# EAGLE design LPC_ERT_30_Thermostat_Adapter_v26_final (EAGLE 5.03)
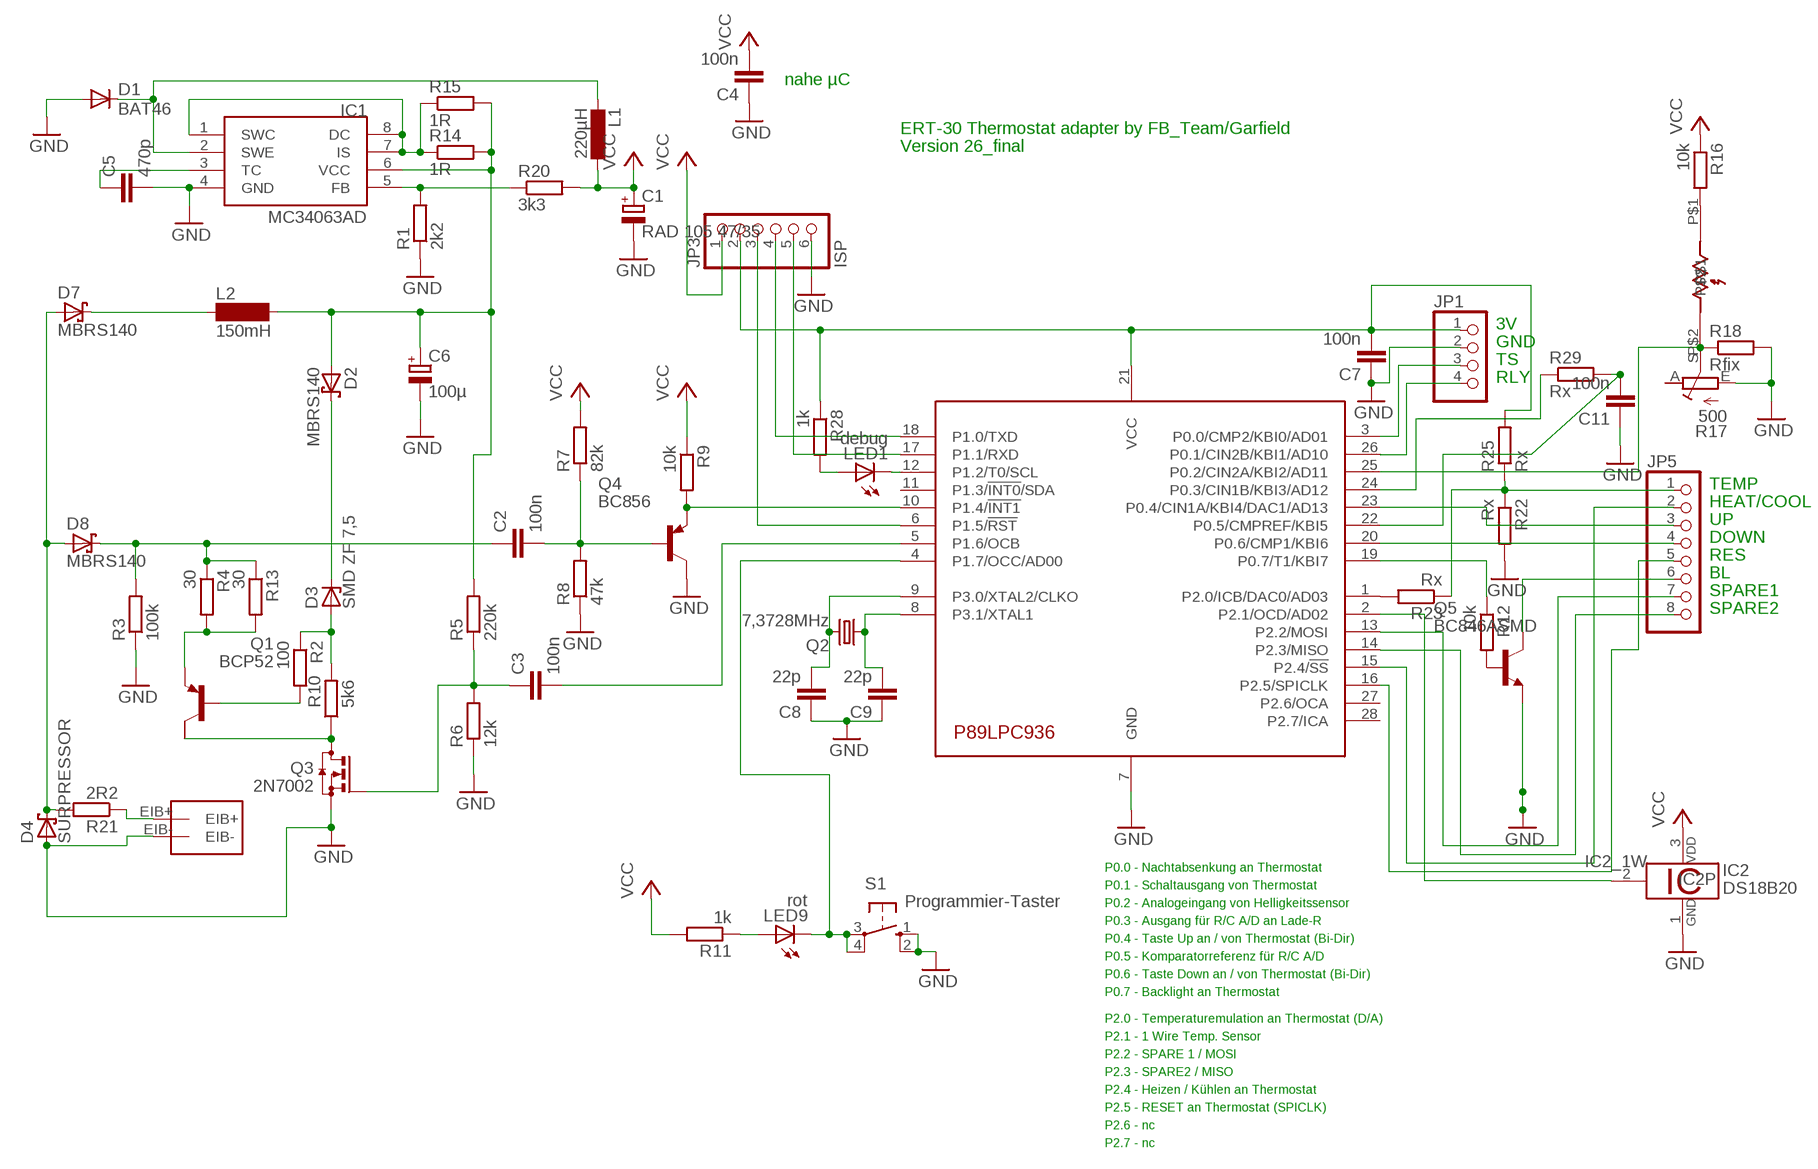
[diagram p0: schematic, sheet 1]

## Parts
C1  RAD 105 47/35  CPOL-EUE2-5  [E2-5]
C2  100n  C-EUC0805  [C0805]
C3  100n  C-EUC0805  [C0805]
C4  100n  C-EUC0805  [C0805]
C5  470p  C-EUC0805  [C0805]
C6  100µ  CPOL-EUE2.5-7  [E2,5-7]
C7  100n  C-EUC0805  [C0805]
C8  22p  C-EUC0805K  [C0805K]
C9  22p  C-EUC0805K  [C0805K]
C11  100n  C-EUC0805  [C0805]
D1  BAT46  DIODE-MINIMELF  [MINIMELF]
D2  MBRS140  MBRS130LT3  [SMB]
D3  SMD ZF 7,5  ZPD  [MINIMELF]
D4  SURPRESSOR  MBRS130LT3  [SMB]
D7  MBRS140  MBRS130LT3  [SMB]
D8  MBRS140  MBRS130LT3  [SMB]
IC1  MC34063AD  [SOIC8]
IC2  DS18B20  [TO92-]
JP1  PINHD-1X4  [1X04]
JP3  ISP  PINHD-1X6  [1X06]
JP5  PINHD-1X8  [1X08]
L1  220µH  L-EU2200-11.43  [2200-11.43]
L2  150mH  SD12-1000  [SD12_1000]
LED1  debug  LEDCHIPLED_1206  [CHIPLED_1206]
LED9  rot  LEDCHIPLED_1206  [CHIPLED_1206]
Q1  BCP52  FZT753SMD  [SOT223]
Q2  7,3728MHz  CRYSTALHC49UP  [HC49UP]
Q3  2N7002  BSS123  [SOT23]
Q4  BC856  BC856ALT1SMD  [SOT23-BEC]
Q5  BC846ASMD  [SOT23]
R1  2k2  R-EU_R0805  [R0805]
R2  100  R-EU_M1206  [M1206]
R3  100k  R-EU_M0805  [M0805]
R4  30  R-EU_R1206  [R1206]
R5  220k  R-EU_M0805  [M0805]
R6  12k  R-EU_M0805  [M0805]
R7  82k  R-EU_R0805  [R0805]
R8  47k  R-EU_M0805  [M0805]
R9  10k  R-EU_R0805  [R0805]
R10  5k6  R-EU_M1206  [M1206]
R11  1k  R-EU_M0805  [M0805]
R12  10k  R-EU_M0805  [M0805]
R13  30  R-EU_R1206  [R1206]
R14  1R  R-EU_M0805  [M0805]
R15  1R  R-EU_M0805  [M0805]
R16  10k  R-EU_M0805  [M0805]
R17  500  R-TRIMM-PT6L  [PT6L]
R18  Rfix  R-EU_M0805  [M0805]
R20  3k3  R-EU_M0805  [M0805]
R21  2R2  R-EU_M1206  [M1206]
R22  Rx  R-EU_M0805  [M0805]
R23  Rx  R-EU_M0805  [M0805]
R25  Rx  R-EU_M0805  [M0805]
R28  1k  R-EU_M0805  [M0805]
R29  Rx  R-EU_M0805  [M0805]
S1  Programmier-Taster  10-XX  [B3F-10XX]
U$1  P89LPC936_SMDPLCC28S  [PLCC28S]
U$2  LDR07  [LDR07]
U$5  EIB-CON  [EIB-CON]

## Nets
GND [supply]: C1.- C4.1 C5.2 C6.- C7.1 C8.1 C9.1 C11.1 D1.A D4.A IC1.4(GND) IC2.1 JP1.2 JP3.6 Q3.2(S) Q4.C Q5.2(E) R1.1 R3.1 R6.1 R8.1 R17.E R18.2 R22.2 S1.1(S) S1.2(S1) U$1.7(GND) U$5.EIB-
N$1: Q4.E R9.2 U$1.10(P1.4/!INT1)
N$2: C2.2 Q4.B R7.1 R8.2
N$3: IC1.5(FB) R1.2 R20.1
N$4: IC1.1(SWC) IC1.7(IS) IC1.8(DC) R14.1 R15.1
N$5: C3.2 U$1.5(P1.6/OCB)
N$6: Q1.2(C) Q3.3(D) R10.1
N$7 [supply]: C6.+ D2.A IC1.6(VCC) L2.2 R5.2 R14.2 R15.2
N$8 [supply]: D7.C L2.1
N$9 [supply]: C2.1 D8.C R3.2 R4.1 R13.1
N$10: D1.C IC1.2(SWE) L1.2
N$11: D3.A R2.1 R10.2
N$12: Q1.3(E) R4.2 R13.2
N$13: C5.1 IC1.3(TC)
N$14: Q1.1(B) R2.2
N$15: C9.2 Q2.1 U$1.8(P3.1/XTAL1)
N$16 [supply]: D4.C D7.A D8.A R21.2
N$17: LED9.C S1.3(P) S1.4(P1) U$1.4(P1.7/OCC/AD00)
N$18: C8.2 Q2.2 U$1.9(P3.0/XTAL2/CLKO)
N$19: JP5.3 U$1.23(P0.4/CIN1A/KBI4/DAC1/AD13)
N$20: Q5.1(B) R12.2
N$21: R12.1 U$1.19(P0.7/T1/KBI7)
N$22: JP1.3 U$1.3(P0.0/CMP2/KBI0/AD01)
N$23: JP1.4 U$1.26(P0.1/CIN2B/KBI1/AD10)
N$24: JP5.6 Q5.3(C)
N$25: JP5.5 U$1.16(P2.5/SPICLK)
N$26: C11.2 R29.2 U$1.22(P0.5/CMPREF/KBI5)
N$27: JP5.2 U$1.15(P2.4/!SS)
N$28: LED1.C U$1.12(P1.2/T0/SCL)
N$29: JP3.4 U$1.18(P1.0/TXD)
N$30: JP3.5 U$1.17(P1.1/RXD)
N$31: JP3.3 U$1.6(P1.5/!RST)
N$33: R16.2 U$2.P$1
N$34: C3.1 Q3.1(G) R5.1 R6.2
N$35: C7.2 JP1.1 JP3.2 R25.2 R28.1 U$1.21(VCC)
N$36: IC2.2 U$1.2(P2.1/OCD/AD02)
N$37: R17.S R18.1 U$1.25(P0.2/CIN2A/KBI2/AD11) U$2.P$2
N$38: JP5.7 U$1.13(P2.2/MOSI)
N$39: R21.1 U$5.EIB+
N$40: D2.C D3.C
N$41: LED9.A R11.1
N$44: JP5.8 U$1.14(P2.3/MISO)
N$46: JP5.1 R22.1 R23.1 R25.1
N$47: R23.2 U$1.1(P2.0/ICB/DAC0/AD03)
N$49: LED1.A R28.2
N$50: R29.1 U$1.24(P0.3/CIN1B/KBI3/AD12)
N$51: JP5.4 U$1.20(P0.6/CMP1/KBI6)
VCC [supply]: C1.+ C4.2 IC2.3 JP3.1 L1.1 R7.2 R9.1 R11.2 R16.1 R20.2
Unconnected: Q1.4(C/) R17.A U$1.11(P1.3/!INT0!/SDA) U$1.27(P2.6/OCA) U$1.28(P2.7/ICA)

## Notes on the sheet
- nahe µC
- ERT-30 Thermostat adapter by FB_Team/Garfield
- Version 26_final
- 3V
- GND
- TS
- RLY
- TEMP
- HEAT/COOL
- UP
- DOWN
- RES
- BL
- SPARE1
- SPARE2
- P0.0 - Nachtabsenkung an Thermostat
- P0.1 - Schaltausgang von Thermostat
- P0.2 - Analogeingang von Helligkeitssensor
- P0.3 - Ausgang für R/C A/D an Lade-R
- P0.4 - Taste Up an / von Thermostat (Bi-Dir)
- P0.5 - Komparatorreferenz für R/C A/D
- P0.6 - Taste Down an / von Thermostat (Bi-Dir)
- P0.7 - Backlight an Thermostat
- P2.0 - Temperaturemulation an Thermostat (D/A)
- P2.1 - 1 Wire Temp. Sensor
- P2.2 - SPARE 1 / MOSI
- P2.3 - SPARE2 / MISO
- P2.4 - Heizen / Kühlen an Thermostat
- P2.5 - RESET an Thermostat (SPICLK)
- P2.6 - nc
- P2.7 - nc

## Library data of the parts
C1 C6 = rcl:CPOL-EU: POLARIZED CAPACITOR, European symbol
C2-C5 C7-C9 C11 = rcl:C-EU: CAPACITOR, European symbol
D1 = diode:DIODE-: DIODE
D2 D4 D7 D8 = diode:MBRS130LT3: Schottky Power Rectifier Source: http://www.onsemi.com/pub/Collateral/MBRS130LT3-D.PDF
D3 = diode:ZPD: Z DIODE 500 mW
IC1 = mc34063:MC34063
IC2 = 1wire:DS18B20: Programmable Resolution Digital Thermometer This chip provides a onewire thermosensor with approx. 0.5°C accuracy. A programmable over/undertemperure alarm is available. The precision can be set from 9..12 bits. Notes: Vdd must be applied for accurate measurements at low temperatures, as the parasite power circuit otherwise heats the sensor. If parasite power is used, Vdd has to be connected to GND. The DS1822 is a low-cost thermometer chip, the DS18S20 is similar to the DS18B20, but with 9 Bit precision only. Author: Jan Kandziora <jjj@gmx.de>
JP1 = pinhead:PINHD-1X4: PIN HEADER
JP3 = pinhead:PINHD-1X6: PIN HEADER
JP5 = pinhead:PINHD-1X8: PIN HEADER
L1 = rcl:L-EU: INDUCTOR, European symbol
L2 = inductor-neosid:SD12: INDUCTOR nominal inductance
LED1 LED9 = led:LED: LED OSRAM: - CHIPLED LG R971, LG N971, LY N971, LG Q971, LY Q971, LO R971, LY R971 LH N974, LH R974 LS Q976, LO Q976, LY Q976 LO Q996 - Hyper CHIPLED LW Q18S LB Q993, LB Q99A, LB R99A - SideLED LS A670, LO A670, LY A670, LG A670, LP A670 LB A673, LV A673, LT A673, LW A673 LH A674 LY A675 LS A676, LA A676, LO A676, LY A676, LW A676 LS A679, LY A679, LG A679 - Hyper Micro SIDELED® LS Y876, LA Y876, LO Y876, LY Y876 LT Y87S - SmartLED LW L88C, LW L88S LB L89C, LB L89S, LG L890 LS L89K, LO L89K, LY L89K LS L896, LA L896, LO L896, LY L896 - TOPLED LS T670, LO T670, LY T670, LG T670, LP T670 LSG T670, LSP T670, LSY T670, LOP T670, LYG T670 LG T671, LOG T671, LSG T671 LB T673, LV T673, LT T673, LW T673 LH T674 LS T676, LA T676, LO T676, LY T676, LB T676, LH T676, LSB T676, LW T676 LB T67C, LV T67C, LT T67C, LS T67K, LO T67K, LY T67K, LW E67C LS E67B, LA E67B, LO E67B, LY E67B, LB E67C, LV E67C, LT E67C LW T67C LS T679, LY T679, LG T679 LS T770, LO T770, LY T770, LG T770, LP T770 LB T773, LV T773, LT T773, LW T773 LH T774 LS E675, LA E675, LY E675, LS T675 LS T776, LA T776, LO T776, LY T776, LB T776 LHGB T686 LT T68C, LB T68C - Hyper Mini TOPLED® LB M676 - Mini TOPLED Santana® LG M470 LS M47K, LO M47K, LY M47K Source: http://www.osram.convergy.de LUXEON: - LUMILED® LXK2-PW12-R00, LXK2-PW12-S00, LXK2-PW14-U00, LXK2-PW14-V00 LXK2-PM12-R00, LXK2-PM12-S00, LXK2-PM14-U00 LXK2-PE12-Q00, LXK2-PE12-R00, LXK2-PE12-S00, LXK2-PE14-T00, LXK2-PE14-U00 LXK2-PB12-K00, LXK2-PB12-L00, LXK2-PB12-M00, LXK2-PB14-N00, LXK2-PB14-P00, LXK2-PB14-Q00 LXK2-PR12-L00, LXK2-PR12-M00, LXK2-PR14-Q00, LXK2-PR14-R00 LXK2-PD12-Q00, LXK2-PD12-R00, LXK2-PD12-S00 LXK2-PH12-R00, LXK2-PH12-S00 LXK2-PL12-P00, LXK2-PL12-Q00, LXK2-PL12-R00 Source: www.luxeon.com KINGBRIGHT: KA-3528ASYC Source: www.kingbright.com
Q1 = transistor-pnp:FZT753SMD: PNP Transistor
Q2 = crystal:CRYSTAL: CRYSTAL
Q3 = transistor-small-signal:BSS123: N-CHANNEL MOS FET
Q4 = transistor-pnp:BC856*: PNP Transistror
Q5 = transistor-npn:BC846*: NPN Transistor
R1-R16 R18 R20-R23 R25 R28 R29 = rcl:R-EU_: RESISTOR, European symbol
R17 = kubi:R-TRIMM
S1 = switch-omron:10-XX: OMRON SWITCH
U$1 = micro-philips:P89LPC936_SMD
U$2 = ldr:LDR07
U$5 = EIBdevices:EIB-CON

## Board
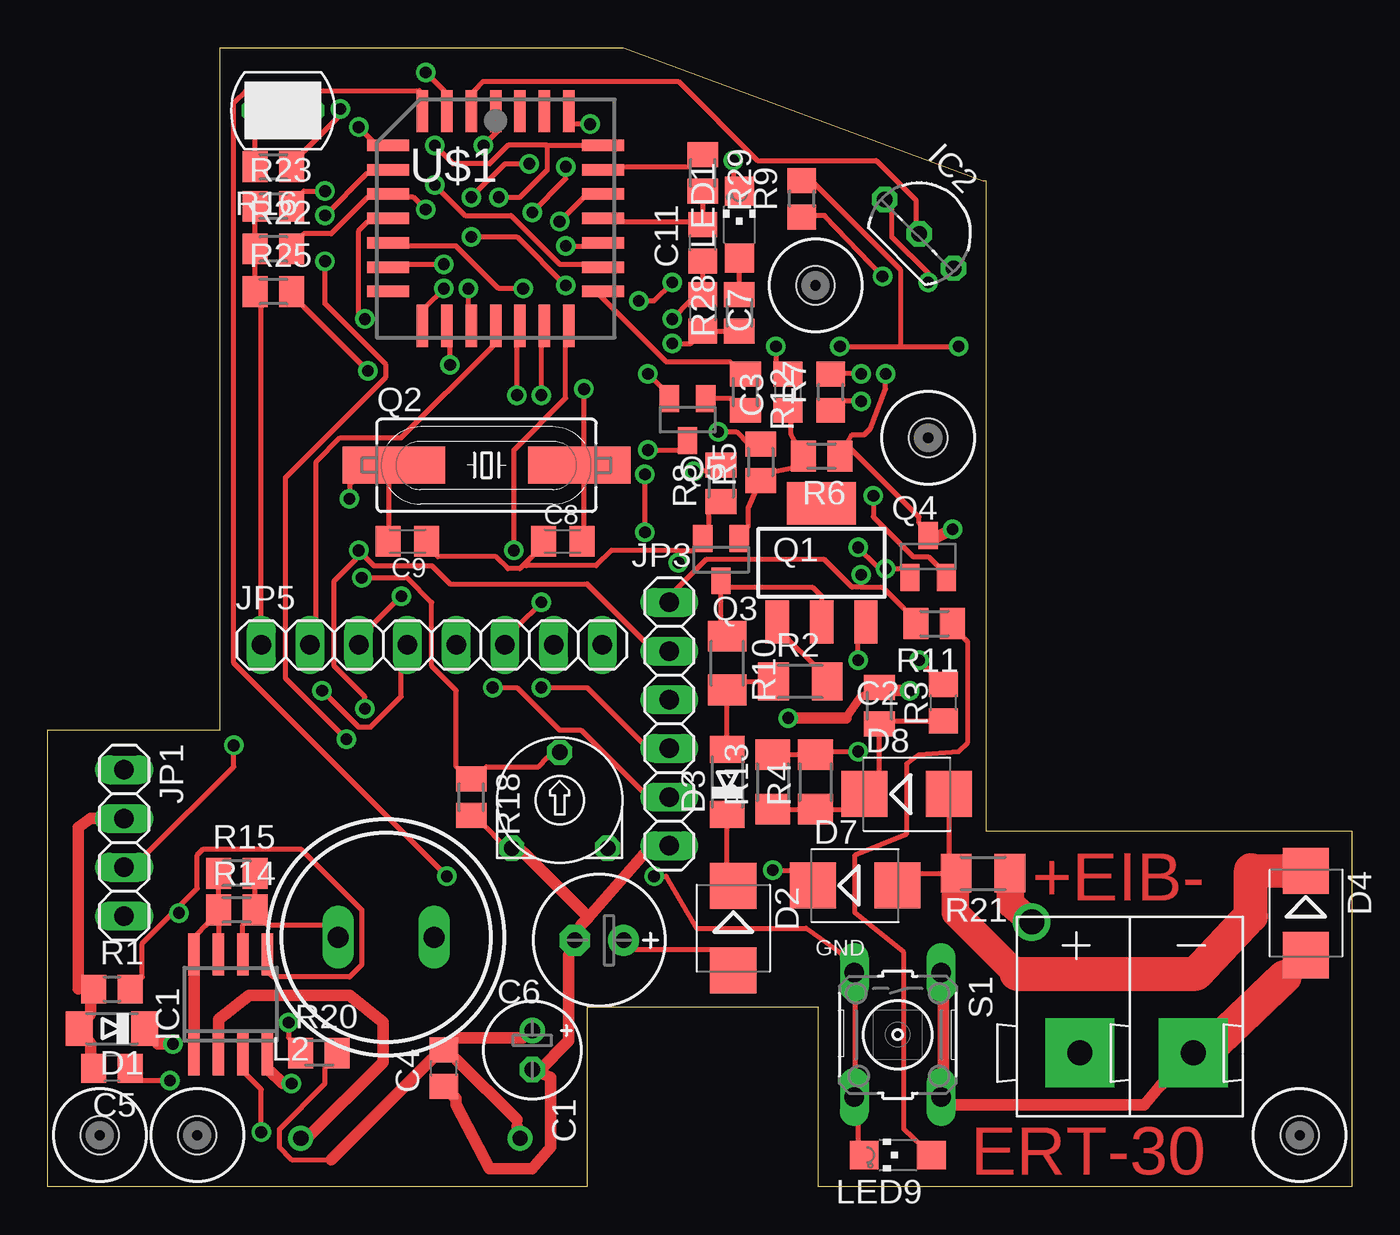
[diagram p1: board, top side]
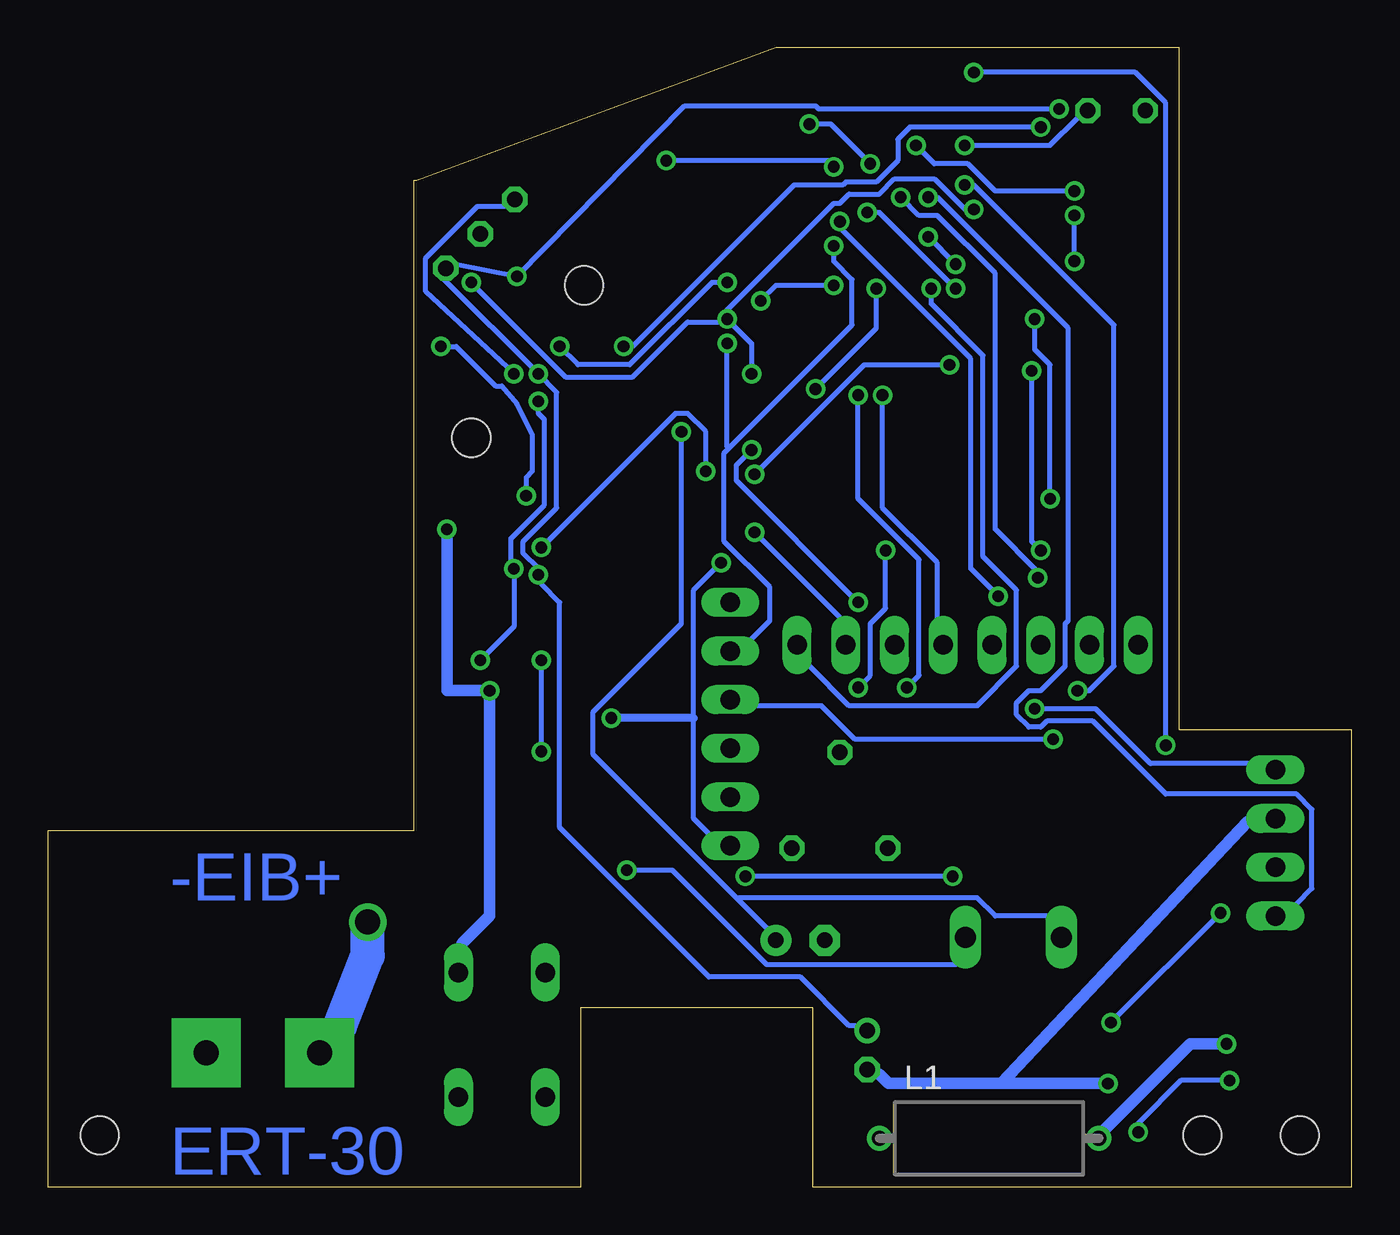
[diagram p2: board, bottom side, seen from below]

Size 67.94 x 59.37 mm. Coordinates in mm from the lower left corner, seen from the top.
Outline: 48.74,52.47 30,59.37 8.97,59.37 8.97,23.81 0,23.81 0,0 28.1,0 28.1,9.37 40.16,9.37 40.16,0 67.94,0 67.94,18.57 48.9,18.57 48.9,52.47 48.74,52.47
Outline: 48.74,52.47 48.74,52.47
Copper layers (1*16): Top 0.035mm / dielectric 1.5mm / Bottom 0.035mm
Design rules "Bilex DRU *": minimum track width 10mil, minimum drill 24mil, track to track 10mil, track to pad 10mil, pad to pad 10mil, via to via 10mil, smd to smd 10mil, copper to edge 20mil, drill to drill 8mil, minimum pad ring 10mil, minimum via ring 8mil, stop-mask expansion 4mil, vias tented up to drill 0mil, thermal gap 10mil

### Footprints (pad centres in the part's own frame; a part is rotated, then mirrored left to right if it is on the bottom)
E2-5 = drill 0.813 pad 1.27 round: + -1.016,0 | drill 0.813 pad 1.27 octagon: - 1.016,0
C0805 = smd 1.3 x 1.5: 1 -0.95,0; 2 0.95,0
E2,5-7 = drill 0.813 pad 1.6 round: + -1.27,0 | drill 0.813 pad 1.6 octagon: - 1.27,0
C0805K = smd 1.3 x 1.6: 1 -1,0; 2 1,0
MINIMELF = smd 1.4 x 1.8: A 1.7,0; C -1.7,0
SMB = smd 2.4 x 2.4: A 2.2,0; C -2.2,0
SOIC8 = smd 0.6 x 2.2: 1 -1.905,-2.6; 2 -0.635,-2.6; 3 0.635,-2.6; 4 1.905,-2.6; 5 1.905,2.6; 6 0.635,2.6; 7 -0.635,2.6; 8 -1.905,2.6
TO92- = drill 0.813 octagon: 1 -2.54,0; 2 0,0; 3 2.54,0
1X04 = drill 1.016 long: 1 -3.81,0; 2 -1.27,0; 3 1.27,0; 4 3.81,0
1X06 = drill 1.016 long: 1 -6.35,0; 2 -3.81,0; 3 -1.27,0; 4 1.27,0; 5 3.81,0; 6 6.35,0
1X08 = drill 1.016 long: 1 -8.89,0; 2 -6.35,0; 3 -3.81,0; 4 -1.27,0; 5 1.27,0; 6 3.81,0; 7 6.35,0; 8 8.89,0
2200-11.43 = drill 0.8 pad 1.27 round: 1 -5.715,0; 2 5.715,0
SD12_1000 = drill 1.1 long: 1 -2.5,0; 2 2.5,0
CHIPLED_1206 = smd 1.5 x 1.5: A 0,-1.75; C 0,1.75
SOT223 = smd 1.219 x 2.235: 1 -2.311,-3.099; 2 0,-3.099; 3 2.311,-3.099 | smd 3.6 x 2.2: 4 0,3.099
HC49UP = smd 5.334 x 1.93: 1 -4.826,0; 2 4.826,0
SOT23 = smd 1 x 1.4: 1 -0.95,-1.1; 2 0.95,-1.1; 3 0,1.1
SOT23-BEC = smd 1 x 1.4: B -0.95,-1.1; C 0,1.1; E 0.95,-1.1
R0805 = smd 1.3 x 1.5: 1 -0.95,0; 2 0.95,0
M1206 = smd 1.6 x 2: 1 -1.4,0; 2 1.4,0
M0805 = smd 1.3 x 1.6: 1 -0.95,0; 2 0.95,0
R1206 = smd 1.6 x 1.803: 1 -1.422,0; 2 1.422,0
PT6L = drill 0.8 octagon: A 2.5,2.5; E 2.5,-2.5; S -2.5,0
B3F-10XX = drill 1.016 long: 1 -3.251,2.261; 2 3.251,2.261; 3 -3.251,-2.261; 4 3.251,-2.261
PLCC28S = smd 0.6 x 2.2: 1 0,5.6; 2 -1.27,5.6; 3 -2.54,5.6; 4 -3.81,5.6; 12 -3.81,-5.6; 13 -2.54,-5.6; 14 -1.27,-5.6; 15 0,-5.6; 16 1.27,-5.6; 17 2.54,-5.6; 18 3.81,-5.6; 26 3.81,5.6; 27 2.54,5.6; 28 1.27,5.6 | smd 2.2 x 0.6: 5 -5.6,3.81; 6 -5.6,2.54; 7 -5.6,1.27; 8 -5.6,0; 9 -5.6,-1.27; 10 -5.6,-2.54; 11 -5.6,-3.81; 19 5.6,-3.81; 20 5.6,-2.54; 21 5.6,-1.27; 22 5.6,0; 23 5.6,1.27; 24 5.6,2.54; 25 5.6,3.81
LDR07 = drill 0.8 octagon: P$1 -1.5,0; P$2 1.5,0
DRIL-2 = hole 2: 0,0
EIB-CON = drill 1.3 pad 3.6 square: EIB+ -5.9,0; EIB- 0,0

### Placement (x,y rotation side)
C1  25.24,7.14 270 top
C2  46.67,25.24 90 top
C3  38.58,41.43 90 top
C4  20.64,6.19 90 top
C5  3.33,6.19 180 top
C6  28.73,12.86 180 top
C7  34.13,45.56 270 top
C8  26.83,33.66 0 top
C9  18.73,33.65 180 top
C11  34.13,49.21 90 top
D1  3.33,8.25 180 top
D2  35.72,13.49 270 top
D3  35.4,21.11 90 top
D4  65.56,14.29 270 top
D7  42.07,15.72 0 top
D8  44.77,20.48 0 top
IC1  9.53,9.53 0 top
IC2  45.4,49.69 315 top
JP1  3.97,17.94 270 top
JP3  32.38,24.13 270 top
JP5  20,28.26 0 top
L1  18.89,2.54 0 bottom
L2  17.62,13.02 180 top
LED1  36.04,50.16 0 top
LED9  44.29,1.67 90 top
Q1  40.32,32.54 0 top
Q2  22.86,37.62 0 top
Q3  35.08,32.7 180 top
Q4  45.88,32.86 0 top
Q5  33.34,40.01 180 top
R1  3.33,10.32 0 top
R2  39.21,26.35 0 top
R3  43.34,25.08 270 top
R4  40,21.11 90 top
R5  37.15,37.78 90 top
R6  40.32,38.1 180 top
R7  40.8,41.43 90 top
R8  35.08,36.67 90 top
R9  39.29,51.51 90 top
R10  35.4,27.3 270 top
R11  46.2,29.37 180 top
R12  36.35,41.43 270 top
R13  37.78,21.11 90 top
R14  9.84,14.45 0 top
R15  9.84,16.35 0 top
R16  11.75,53.18 180 top
R17  26.67,20.16 270 top
R18  22.07,20.32 270 top
R20  14.13,6.99 0 top
R21  48.74,16.35 180 top
R22  47k  [M0805]  11.75,48.9 0 top
R23  47k  [M0805]  11.75,51.12 0 top
R25  47k  [M0805]  11.75,46.67 0 top
R28  36.04,45.56 90 top
R29  100k  [M0805]  34.13,52.86 270 top
S1  44.29,7.94 270 top
U$1  23.34,50.48 0 top
U$2  12.25,56.11 0 top
U$3  [DRIL-2]  45.88,39.05 0 top
U$4  [DRIL-2]  40.01,46.99 0 top
U$5  59.69,6.99 0 top
U$6  [DRIL-2]  2.7,2.7 0 top
U$7  [DRIL-2]  7.78,2.7 0 top
U$8  [DRIL-2]  65.25,2.7 0 top

### Tracks (layer width: path | path; a pad name or v marks a point on that pad's centre or on a via)
GND  (via drill 0.61)
  Top 0.254: R8.1 34.45,35.4 34.45,34.45 Q3.2 33.66,33.18 32.86,33.18 | 24.84,32.46 25.24,32.86 C8.1 | 24.84,32.46 24.61,32.23 23.97,32.23 23.34,32.86 20.32,32.86 C9.1 | 32.86,33.18 29.37,33.18 28.58,32.38 24.92,32.38 24.84,32.46 | R18.2 22.86,18.73 23.65,17.94 R17.E | v32.86,32.54 32.86,33.18 | C5.2 2.22,6.83 | 2.22,9.68 R1.1 1.59,10.32 | 11.59,6.03 IC1.4 | R22.2 13.34,49.69 14.76,49.69 16.67,51.59 U$1.7 18.73,51.59 19.05,51.59 v19.68,50.96 | v31.27,42.39 31.91,41.75 Q5.2 | v32.54,45.24 33.5,46.2 C7.1 34.13,47.62 C11.1 | v43.66,42.39 43.66,41.59 42.86,39.53 42.55,39.21 41.91,39.21 R6.1 41.91,38.42 45.4,34.92 45.4,34.61 Q4.C 46.2,33.81 | 64.45,10.95 D4.A | R3.1 44.13,25.88 | v45.88,47.15 45.88,47.62 43.97,49.53 43.97,50.96 IC2.1 | JP1.2 | 57.94,5.24
  Top 0.406: 41.59,24.45 42.39,25.56 R3.1
  Top 0.61: 28.18,14.05 27.78,13.65 C6.- 27.15,12.07 27.15,7.62 25.56,6.03 C1.- 26.19,5.71 26.19,2.06 25.24,0.95 23.02,0.95 21.27,4.29 21.27,4.6 C4.1 | 28.18,14.05 31.43,17.78 JP3.6 | R17.E 24.77,17.46 28.18,14.05 | 2.22,6.83 2.22,7.46 D1.A 2.22,9.05 2.22,9.68 | JP1.2 2.22,19.21 1.59,18.73 1.59,10.32 | 11.59,6.03 12.22,5.4 v12.7,5.4 | 44.13,25.88 v44.93,25.88 | S1.1 46.67,9.68 46.67,6.19 S1.2 46.99,4.29 57.15,4.29 57.94,5.24 U$5.EIB- | v47.15,34.29 46.2,33.81 | v38.58,24.45 41.59,24.45
  Top 1.778: 64.45,10.95 60.96,7.62 U$5.EIB-
  Bottom 0.254: v32.86,32.54 34.29,31.12 34.29,24.45 34.29,19.21 33.5,18.41 JP3.6 | v31.27,42.39 31.27,43.97 v32.54,45.24 | v19.68,50.96 20.16,50.96 21.75,52.55 23.81,52.55 24.61,51.75 26.19,51.75 26.67,51.28 26.99,51.28 32.54,45.72 v32.54,45.24 | v43.66,42.39 48.26,46.67 48.26,48.42 45.56,51.12 44.13,51.12 IC2.1 | v44.93,25.88 45.09,25.88 | v45.88,47.15 40.96,42.23 37.46,42.23 34.61,45.09 33.02,45.09 v32.54,45.24
  Bottom 0.406: 34.29,24.45 v38.58,24.45
  Bottom 0.61: 18.26,5.4 24.13,5.4 24.61,5.87 C1.- | 18.26,5.4 v12.7,5.4 | 18.26,5.4 5.4,19.05 JP1.2 | v44.93,25.88 44.93,14.13 46.35,12.7 S1.1 | v47.15,34.29 47.15,25.88 45.09,25.88
N$1  (via drill 0.61)
  Top 0.254: v43.02,36.04 43.02,34.92 45.09,32.86 45.88,32.86 46.35,32.38 Q4.E | 44.45,43.81 44.45,47.78 39.53,52.7 R9.2 | 44.45,43.81 v47.47,43.81 | v20.64,48.1 18.73,48.1 U$1.10 | v22.07,49.53 24.45,49.53 v26.99,46.99 | v30.8,46.2 31.59,46.2 v32.54,47.15 | v41.27,43.81 44.45,43.81
  Bottom 0.254: v43.02,36.04 43.02,36.99 42.7,37.31 42.7,39.21 43.5,40.8 44.29,41.75 44.61,41.75 46.67,43.81 v47.47,43.81 | v20.64,48.1 v22.07,49.53 | v26.99,46.99 30,46.99 v30.8,46.2 | v32.54,47.15 33.34,47.15 37.62,42.86 40.32,42.86 v41.27,43.81
N$2  (via drill 0.61)
  Top 0.254: v45.4,27.46 46.04,26.83 C2.2 | Q4.B 44.45,32.23 v43.66,32.23 43.18,32.38 v42.23,33.34 | v42.39,40.96 41.43,40.96 R7.1 | v33.66,37.31 34.45,37.31 R8.2
  Bottom 0.254: v45.4,27.46 43.66,29.21 v43.66,32.23 43.81,32.7 43.81,33.81 42.07,35.56 42.07,40.01 42.39,40.32 v42.39,40.96 | v33.66,37.31 33.66,39.37 34.61,40.32 35.24,40.32 v42.23,33.34
N$3  (via drill 0.61)
  Top 0.254: 6.59,14.37 7.78,15.56 7.78,17.3 8.1,17.62 13.18,17.62 16.35,14.45 16.35,11.59 15.72,10.95 11.75,10.95 11.59,11.11 IC1.5 | 6.59,14.37 4.92,12.7 4.92,10.95 R1.2 | v12.54,8.57 12.54,7.78 R20.1 | v6.83,14.29 6.67,14.29 6.59,14.37
  Bottom 0.254: v6.83,14.29 v12.54,8.57
N$4
  Top 0.254: R15.1 8.89,15.56 8.89,15.24 R14.1 | IC1.7 8.89,13.18 8.89,13.65 R14.1 | IC1.1 7.62,7.94 | 7.62,11.11 IC1.8 7.78,13.18 8.25,13.65 R14.1
  Top 0.61: 7.62,7.94 7.62,11.11
N$5  (via drill 0.61)
  Top 0.254: v37.94,43.81 37.94,43.02 C3.2 | v16.19,55.24 16.99,54.45 U$1.5
  Bottom 0.254: v37.94,43.81 37.46,43.81 29.05,52.23 26.51,52.23 26.35,52.39 24.77,52.39 23.65,53.5 23.65,54.61 23.02,55.24 v16.19,55.24
N$6
  Top 0.254: R10.1 35.08,29.37 Q3.3 35.56,31.27 39.85,31.27 40.32,30.8 40.32,30.32 Q1.2
N$7  (via drill 0.61)
  Top 0.254: R14.2 10.79,15.24 10.79,15.56 R15.2 | IC1.6 10.16,13.18 10.16,13.65 R14.2 | L2.2 14.45,13.65 11.43,13.65 R14.2 | v34.92,39.37 35.88,39.37 36.51,38.73 36.51,38.58 R5.2 | D2.A 34.61,12.38 30.64,12.38 C6.+
  Bottom 0.254: v34.92,39.37 34.92,29.37 39.53,24.77 39.53,22.54 31.99,15 | 31.99,15 30.48,13.49 C6.+ | L2.2 15.88,14.13 18.57,14.13 19.53,15.08 31.91,15.08 31.99,15
N$8  (via drill 0.61)
  Top 0.254: v37.78,16.51 38.73,16.51 D7.C
  Bottom 0.254: v37.78,16.51 35.4,16.51 30.48,11.59 20.64,11.59 L2.1
N$9
  Top 0.254: C2.1 46.04,24.29 44.13,24.29 R3.2 43.34,21.59 D8.C 41.43,19.69 40.8,19.69 R4.1 39.21,19.69 38.58,19.69 R13.1
N$10  (via drill 0.61)
  Top 0.61: v6.51,7.46 5.71,7.46 D1.C | IC1.2 8.89,8.73 10.48,10 15.72,10 17.46,8.57 17.46,6.51 13.49,2.54 L1.2
  Bottom 0.61: v6.51,7.46 8.41,7.46 13.18,2.7 L1.2
N$11
  Top 0.254: D3.A 35.4,23.5 35.4,25.24 R10.2 36.35,26.35 37.15,26.35 R2.1
N$12  (via drill 0.61)
  Top 0.254: R13.2 38.58,22.54 39.21,22.54 R4.2 40.8,22.7 v42.23,22.7 | v42.23,27.46 42.23,28.58 Q1.3
  Bottom 0.254: v42.23,22.7 v42.23,27.46
N$13  (via drill 0.61)
  Top 0.254: v6.35,5.56 4.92,5.56 C5.1 | v11.11,2.86 11.11,5.08 10.32,5.87 IC1.3
  Bottom 0.254: v6.35,5.56 8.89,5.56 11.11,3.33 v11.11,2.86
N$14
  Top 0.254: R2.2 39.85,27.3 38.58,28.58 Q1.1
N$15  (via drill 0.61)
  Top 0.254: C9.2 17.78,34.45 17.78,36.67 Q2.1 15.72,36.67 v15.72,35.88 | v16.51,45.24 16.19,45.56 16.19,49.85 16.67,50.32 U$1.8
  Bottom 0.254: v16.51,45.24 16.51,43.66 15.72,42.86 v15.72,35.88
N$16
  Top 0.254: D7.A 45.4,16.35 46.67,16.35 R21.2 46.99,17.3 46.99,19.37 D8.A
  Top 1.422: 50.48,11.11 47.31,14.29 R21.2
  Top 1.778: 50.48,11.11 59.85,11.11 62.71,14.13 62.71,16.51 D4.C
N$17  (via drill 0.61)
  Top 0.254: LED9.C 42.23,2.38 42.23,3.17 S1.4 42.07,6.19 42.07,9.68 S1.3 41.27,12.22 39.53,13.49 33.81,13.49 32.23,16.19 v31.59,16.19 | v20.8,16.19 9.68,27.3 9.68,56.52 10.32,57.15 19.37,57.15 U$1.4
  Bottom 0.254: v20.8,16.19 v31.59,16.19
N$18  (via drill 0.61)
  Top 0.254: C8.2 27.94,34.45 27.94,36.67 Q2.2 27.94,38.58 v27.94,41.59 | v24.77,46.83 23.5,46.83 21.27,49.05 18.73,49.05 U$1.9
  Bottom 0.254: v24.77,46.83 24.77,44.77 v27.94,41.59
N$19  (via drill 0.61)
  Top 0.254: v26.67,50.32 27.94,51.59 U$1.23 | v18.41,30.8 16.83,29.21 JP5.3
  Bottom 0.254: v26.67,50.32 26.67,50.01 19.84,43.18 19.84,32.23 v18.41,30.8
N$20
  Top 0.254: Q5.1 34.77,41.12 35.56,41.12 R12.2
N$21
  Top 0.254: R12.1 35.56,43.02 32.23,43.02 28.73,46.51 U$1.19
N$22  (via drill 0.61)
  Top 0.254: v19.68,58.1 20.64,57.15 U$1.3 | v9.68,23.02 9.68,21.91 5.08,17.3 JP1.3
  Bottom 0.254: v19.68,58.1 11.27,58.1 9.68,56.52 v9.68,23.02
N$23  (via drill 0.61)
  Top 0.254: v28.26,55.4 27.3,55.4 U$1.26 | v25.08,53.34 23.81,53.34 v22.07,51.59
  Bottom 0.254: v28.26,55.4 27.15,55.4 v25.08,53.34 | v22.07,51.59 21.59,51.59 14.76,44.77 14.76,29.53 14.92,29.37 14.92,27.15 16.19,25.88 16.83,25.88 17.46,25.24 17.46,24.61 16.83,23.97 16.19,23.97 15.88,24.29 13.49,24.29 9.68,20.48 2.86,20.48 2.06,19.69 2.06,15.56 2.86,14.76 JP1.4
N$24  (via drill 0.61)
  Top 0.254: v31.27,38.42 32.86,38.42 Q5.3 | v25.72,30.48 24.45,29.21 JP5.6
  Bottom 0.254: v31.27,38.42 32.07,37.62 32.07,36.83 v25.72,30.48
N$25  (via drill 0.61)
  Top 0.254: v24.45,41.27 24.45,43.81 U$1.16
  Bottom 0.254: v24.45,41.27 24.45,35.4 21.59,32.54 21.59,29.69 JP5.5
N$26
  Top 0.254: R29.2 34.13,51.28 34.13,50.8 C11.2 33.5,50.32 30,50.32 U$1.22
N$27
  Top 0.254: U$1.15 23.18,43.81 18.41,39.05 15.24,39.05 13.97,37.78 13.97,29.69 JP5.2
N$28  (via drill 0.61)
  Top 0.254: v35.72,53.5 35.72,52.55 LED1.C | v26.99,53.18 26.99,52.55 v25.24,50.8 | v20.64,46.83 19.68,45.88 U$1.12
  Bottom 0.254: v35.72,53.5 27.3,53.5 v26.99,53.18 | v25.24,50.8 24.61,50.8 v20.64,46.83
N$29  (via drill 0.61)
  Top 0.254: v24.29,33.18 24.29,38.42 26.99,41.12 26.99,43.81 U$1.18 | v25.72,26.04 28.1,26.04 30.96,23.18 JP3.4
  Bottom 0.254: v24.29,33.18 24.29,30.16 25.08,29.37 25.08,26.67 v25.72,26.04
N$30  (via drill 0.61)
  Top 0.254: v25.72,41.27 25.72,43.81 U$1.17 | v23.18,26.04 24.45,26.04 26.67,23.81 27.78,23.81 30.96,20.64 JP3.5
  Bottom 0.254: v25.72,41.27 25.72,35.88 22.54,32.7 22.54,26.67 v23.18,26.04
N$31  (via drill 0.61)
  Top 0.254: v14.45,50.64 16.67,52.86 U$1.6 | v14.45,48.26 14.45,46.04 17.62,42.86 17.62,42.23 12.38,36.99 12.38,26.51 v15.56,23.34
  Bottom 0.254: v14.45,48.26 v14.45,50.64 | v15.56,23.34 25.88,23.34 27.62,25.08 30.96,25.08 JP3.3
N$33
  Top 0.254: R16.2 10.79,53.98 10.79,55.56 U$2.P$1
N$34
  Top 0.254: C3.1 38.73,39.85 38.73,39.21 R6.2 38.73,37.47 37.94,37.31 R5.1 36.51,35.4 36.51,34.45 Q3.1
N$35  (via drill 0.61)
  Top 0.254: R28.1 35.24,44.61 34.77,44.61 C7.2 33.5,43.97 v32.54,43.97 | v16.67,42.55 13.34,45.88 R25.2 | JP3.2 31.12,28.42 28.1,31.43 20.95,31.43 20,32.38 16.99,32.38 v16.19,33.18 16.03,32.7 14.92,31.59 14.92,27.15 16.51,25.56 v16.51,24.92 | v26.99,49.05 27.94,49.05 U$1.21
  Bottom 0.254: v16.67,42.55 16.67,33.66 v16.19,33.18 | v26.99,49.05 26.99,48.26 26.04,47.31 26.04,44.93 32.46,38.5 | 32.46,38.5 32.7,38.26 32.7,33.66 30.32,31.27 30.32,29.53 31.27,28.58 JP3.2 | v32.54,43.97 32.54,38.58 32.46,38.5 | v16.51,24.92 13.34,24.92 10.48,22.07 5.4,22.07 JP1.1
N$36
  Top 0.254: U$1.2 22.23,57.15 22.7,57.63 32.86,57.63 36.99,53.5 43.18,53.5 45.24,51.44 45.24,50.32 IC2.2
N$37  (via drill 0.61)
  Top 0.254: R17.S 26.04,22.38 25.56,21.91 22.86,21.91 R18.1 21.27,21.91 21.27,25.88 20,27.15 20,30.48 18.73,31.75 v16.35,31.75 | 26.04,54.29 23.97,54.29 23.02,53.34 21.11,53.34 v20.16,54.29 | 26.04,54.29 27.94,54.29 U$1.25 | v23.5,51.59 24.61,51.59 26.04,53.02 26.04,54.29
  Bottom 0.254: v20.16,54.29 15.72,54.29 14.29,55.72 U$2.P$2 | v16.35,31.75 16.35,32.07 18.57,34.29 18.57,47.62 21.59,50.64 22.54,50.64 v23.5,51.59
N$38  (via drill 0.61)
  Top 0.254: v20.95,42.86 20.95,43.81 U$1.13 | v31.12,34.13 v31.12,37.15
  Bottom 0.254: v20.95,42.86 25.4,42.86 v31.12,37.15 | v31.12,34.13 26.67,29.69 JP5.7
N$39  (via drill 1.3)
  Top 1.422: v51.28,13.81 50.16,14.76 R21.1
  Bottom 1.778: v51.28,13.81 51.28,12.07 52.7,8.41 U$5.EIB+
N$40
  Top 0.254: D3.C 35.4,18.73 35.4,16.83 D2.C
N$41
  Top 0.254: LED9.A 44.61,3.02 44.61,12.22 42.07,14.29 42.07,17.3 44.77,18.41 44.77,22.07 45.4,22.54 47.47,22.7 47.94,23.18 47.94,28.42 47.78,28.58 R11.1
N$44  (via drill 0.61)
  Top 0.254: v21.91,46.83 21.91,45.88 U$1.14
  Bottom 0.254: v21.91,46.83 21.91,46.04 19.21,43.34 19.21,32.86 17.46,31.12 17.46,27.15 19.53,25.08 26.19,25.08 28.26,27.15 JP5.8
N$46
  Top 0.254: R23.1 10.79,50.32 10.79,49.69 R22.1 10.79,48.1 10.79,47.47 R25.1 11.11,45.88 JP5.1
N$47  (via drill 0.61)
  Top 0.254: v14.45,51.91 13.34,51.91 R23.2 | v22.7,54.29 23.5,55.09 U$1.1
  Bottom 0.254: v14.45,51.91 18.57,51.91 20,53.34 21.75,53.34 v22.7,54.29
N$49
  Top 0.254: LED1.A 36.04,47.78 36.04,47.15 R28.2
N$50
  Top 0.254: R29.1 33.34,53.18 30,53.18 U$1.24
N$51  (via drill 0.61)
  Top 0.254: v20.16,52.23 21.75,50.64 24.13,50.64 26.67,48.1 27.94,48.1 U$1.20 | v14.29,25.88 16.19,23.97 16.83,23.97 18.41,25.56 18.41,26.83 JP5.4
  Bottom 0.254: v20.16,52.23 19.68,52.23 12.38,44.93 12.38,27.15 13.65,25.88 v14.29,25.88
VCC  (via drill 0.61)
  Top 0.254: C4.2 21.27,7.78 | 14.76,1.43 12.7,1.43 12.07,2.06 12.07,3.02 14.45,5.4 14.45,6.19 R20.2 | 20,6.67 C4.2 | 24.45,3.49 24.45,3.17 | C4.2 21.27,6.67 | 42.39,31.27 41.91,31.27 40.48,32.7 34.29,32.7 32.7,31.12 JP3.1 | 42.39,31.27 43.5,31.27 44.61,30.16 R11.2 | v42.39,42.39 41.43,42.39 R7.2 | v43.5,47.47 40.48,50.64 39.53,50.64 R9.1 | v15.24,56.2 15.24,55.88 13.34,53.98 R16.1 | v42.39,31.91 42.39,31.27
  Top 0.61: 21.27,7.78 24.77,7.78 C1.+ | 14.76,1.43 20,6.67 | 21.27,6.67 24.45,3.49 | 24.45,3.17 L1.1
  Bottom 0.254: v15.24,56.2 27.78,56.2 27.94,56.36 34.77,56.36 v43.5,47.47 46.67,48.1 IC2.3 47.31,47.31 v42.39,42.39 41.43,41.43 41.43,35.4 43.18,33.66 43.18,33.02 42.39,32.23 v42.39,31.91 42.23,31.43 41.27,30.48 41.27,18.73 33.5,10.95 28.73,10.95 26.19,8.41 25.88,8.41 C1.+

### Text on the board
Top: +EIB- | ERT-30
Bottom: -EIB+ | ERT-30
tPlace: GND